# Altium project Control.PrjPCB
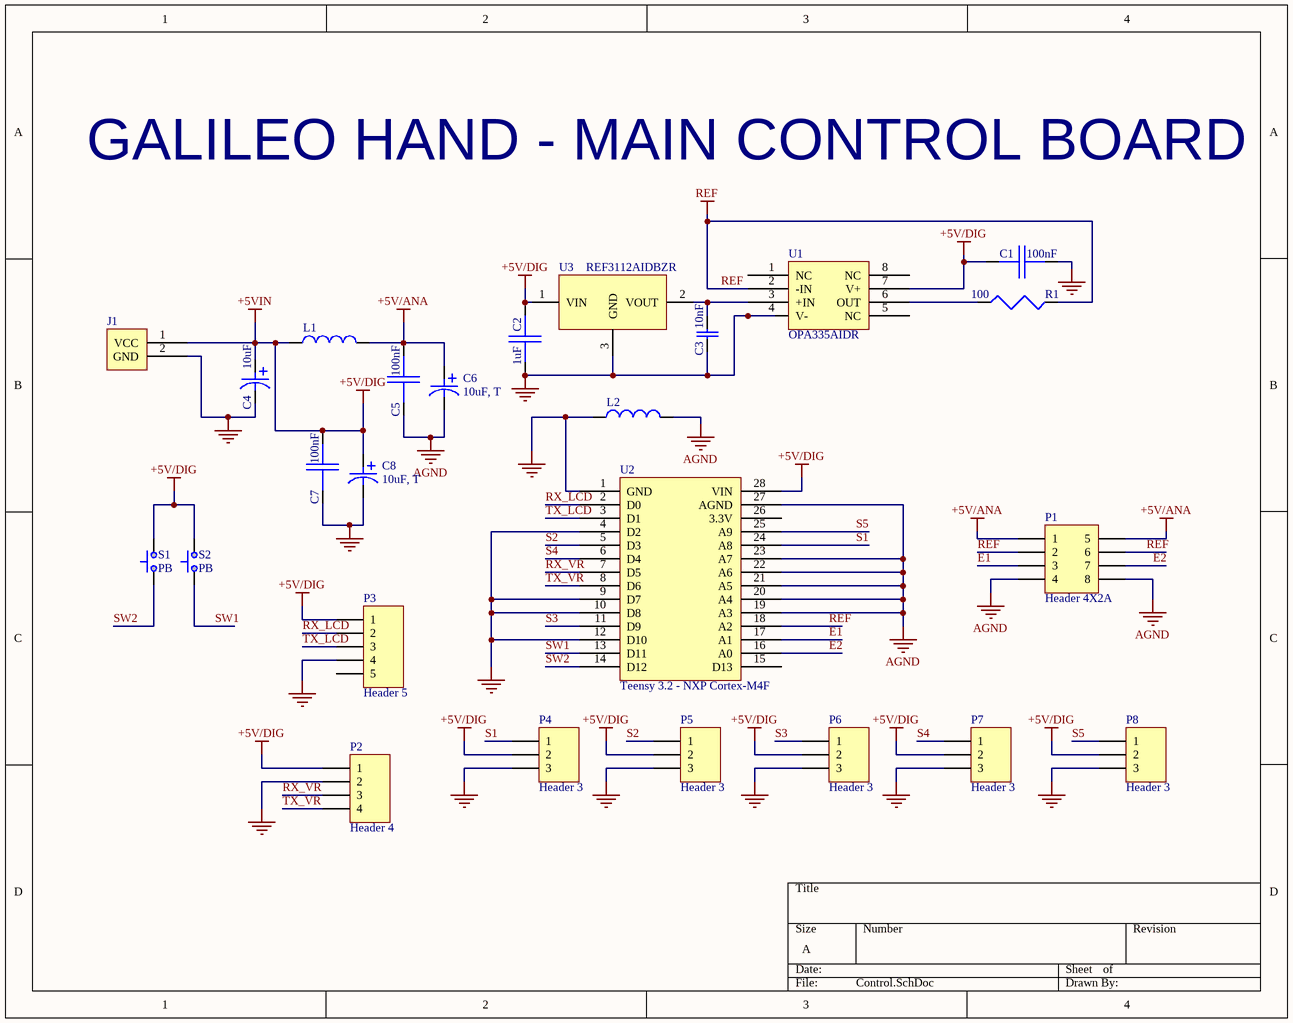
[diagram p0: Control.SchDoc]
1 sheet, 25 parts. Net scope: global (net labels, ports and power ports of the same name join across sheets).
Board file: Control.PcbDoc

## Sheet Control.SchDoc
size A

### Parts
C1  100nF  [C0603]
C2  1uF  [C0603]
C3  10nF  [C0805]
C4  10uF  [CSVB]
C5  100nF  [C0603]
C6  10uF, T  [C1206]
C7  100nF  [C0603]
C8  10uF, T  [C1206]
J1  TERMINAL BLOCK  2POS 3.5MM  [2POS3.5mm]  (value not drawn)
L1  EMI FILTER BED  [R0603]  (value not drawn)
L2  EMI FILTER BED  [R0603]  (value not drawn)
P1  Header 4X2A  [HDR2X4_CEN]
P2  Header 4  [HDR1X4]
P3  Header 5  [HDR1X5]
P4  Header 3  [HDR1X3]
P5  Header 3  [HDR1X3]
P6  Header 3  [HDR1X3]
P7  Header 3  [HDR1X3]
P8  Header 3  [HDR1X3]
R1  100  [R0603]
S1  PB  [SW]
S2  PB  [SW]
U1  OPA335AIDR  [SO-8]
U2  Teensy 3.2 - NXP Cortex-M4F  [DIP28]
U3  REF3112AIDBZR  [SOT-23]

### Nets
+5V/ANA: C5.2 C6.1 L1.2 P1.1 P1.5
+5V/DIG: C1.2 C2.2 C4.1 C7.2 C8.1 J1.1(VCC) L1.1 P2.1 P3.1 P4.2 P5.2 P6.2 P7.2 P8.2 S1.2 S2.2 U1.7(V+) U2.28(VIN) U3.1(VIN)  [also labelled +5VIN]
AGND: C5.1 C6.2 L2.2 P1.4 P1.8 U2.19(A3) U2.20(A4) U2.21(A5) U2.22(A6) U2.23(A7) U2.27(AGND)
GND: C1.1 C2.1 C3.1 C4.2 C7.1 C8.2 J1.2(GND) L2.1 P2.2 P3.4 P4.3 P5.3 P6.3 P7.3 P8.3 U1.4(V-) U2.1(GND) U2.4(D2) U2.9(D7) U2.10(D8) U2.12(D10) U3.3(GND)
REF: P1.2 P1.6 R1.1 U1.2(-IN) U2.18(A2)
E1: P1.3 U2.17(A1)
E2: P1.7 U2.16(A0)
RX_LCD: P3.2 U2.2(D0)
RX_VR: P2.3 U2.7(D5)
S1: P4.1 U2.24(A8)
S2: P5.1 U2.5(D3)
S3: P6.1 U2.11(D9)
S4: P7.1 U2.6(D4)
S5: P8.1 U2.25(A9)
SW1: S2.1 U2.13(D11)
SW2: S1.1 U2.14(D12)
TX_LCD: P3.3 U2.3(D1)
TX_VR: P2.4 U2.8(D6)
NetC3_2: C3.2 U1.3(+IN) U3.2(VOUT)
NetR1_2: R1.2 U1.6(OUT)

Not connected (* = marked no-connect by the designer): P3 5; U1 1(NC) 5(NC) 8(NC); U2 15(D13) 26(3.3V)

### Notes on the sheet
- GALILEO HAND - MAIN CONTROL BOARD

### Library data of the parts
C1 C5 C7 = GRM188R71E104KA01D: CAP CER 0.1UF 25V X7R 0603; Manufacturer: Murata Electronics North America; Capacitance: 0.1µF; Tolerance: ±10%; Supplier 1: Digi-Key; Manufacturer Part Number: GRM188R71E104KA01D; RoHS: RoHS Compliant; Category: Capacitors; Stock 1: 5973420; Pricing 1: 1=0.1, 10=0.019, 50=0.0104, 100=0.0088, 250=0.0072, 500=0.00616, 1000=0.0048 (USD); Packaging: Cut Tape (CT); Voltage - Rated: 25V; Temperature Coefficient: X7R; Mounting Type: Surface Mount, MLCC; Operating Temperature: -55°C ~ 125°C; Applications: General Purpose; Ratings: -; Package / Case: 0603 (1608 Metric); Size / Dimension: 0.063" L x 0.031" W (1.60mm x 0.80mm); Height - Seated (Max): -; Thickness (Max): 0.035" (0.90mm); Lead Spacing: -; Features: -; Lead Style: -; ComponentLink1URL: http://www.murata.com/~/media/webrenewal/support/library/catalog/products/capacitor/mlcc/c02e.pdf; ComponentLink1Description: http://www.murata.com/~/media/webrenewal/support/library/catalog/products/capacitor/mlcc/c02e.pdf; Supplier Part Number 1: 490-1524-1-ND
C2 = GRM188R61E105KA12D: CAP CER 1UF 25V X5R 0603; Manufacturer: Murata Electronics North America; Capacitance: 1µF; Tolerance: ±10%; Supplier 1: Digi-Key; Manufacturer Part Number: GRM188R61E105KA12D; RoHS: RoHS Compliant; Category: Capacitors; Stock 1: 1934941; Pricing 1: 1=0.1, 10=0.044, 50=0.0238, 100=0.0202, 250=0.01652, 500=0.01412, 1000=0.01101 (USD); Packaging: Cut Tape (CT); Voltage - Rated: 25V; Temperature Coefficient: X5R; Mounting Type: Surface Mount, MLCC; Operating Temperature: -55°C ~ 85°C; Applications: General Purpose; Ratings: -; Package / Case: 0603 (1608 Metric); Size / Dimension: 0.063" L x 0.031" W (1.60mm x 0.80mm); Height - Seated (Max): -; Thickness (Max): 0.035" (0.90mm); Lead Spacing: -; Features: -; Lead Style: -; ComponentLink1URL: http://www.murata.com/~/media/webrenewal/support/library/catalog/products/capacitor/mlcc/c02e.pdf; ComponentLink1Description: http://www.murata.com/~/media/webrenewal/support/library/catalog/products/capacitor/mlcc/c02e.pdf; Supplier Part Number 1: 490-3897-1-ND
C3 = GRM216R71H103KA01D: CAP CER 10000PF 50V X7R 0805; Manufacturer: Murata Electronics North America; Tolerance: ±10%; Supplier 1: Digi-Key; Manufacturer Part Number: GRM216R71H103KA01D; RoHS: RoHS Compliant; Category: Capacitors; Stock 1: 1473285; Pricing 1: 1=0.1, 10=0.031, 50=0.0168, 100=0.0142, 250=0.01164, 500=0.00998, 1000=0.00777 (USD); Packaging: Cut Tape (CT); Capacitance: 10000pF; Voltage - Rated: 50V; Temperature Coefficient: X7R; Mounting Type: Surface Mount, MLCC; Operating Temperature: -55°C ~ 125°C; Applications: General Purpose; Ratings: -; Package / Case: 0805 (2012 Metric); Size / Dimension: 0.079" L x 0.049" W (2.00mm x 1.25mm); Height - Seated (Max): -; Thickness (Max): 0.028" (0.70mm); Lead Spacing: -; Features: -; Lead Style: -; ComponentLink1URL: http://www.murata.com/~/media/webrenewal/support/library/catalog/products/capacitor/mlcc/c02e.pdf; ComponentLink1Description: http://www.murata.com/~/media/webrenewal/support/library/catalog/products/capacitor/mlcc/c02e.pdf; Supplier Part Number 1: 490-1664-1-ND
C4 = EEE-1EA100WR: CAP ALUM 10UF 20% 25V SMD; Manufacturer: Panasonic Electronic Components; Capacitance: 10µF; Lifetime @ Temp.: 1000 Hrs @ 85°C; Ripple Current: 22mA; Surface Mount Land Size: 0.169" L x 0.169" W (4.30mm x 4.30mm); Supplier 1: Digi-Key; Manufacturer Part Number: EEE-1EA100WR; RoHS: RoHS Compliant; Category: Capacitors; Stock 1: 144383; Pricing 1: 1=0.41, 10=0.319, 25=0.2612, 50=0.2102, 100=0.1668, 250=0.12324, 500=0.0957, 1000=0.0754 (USD); Packaging: Cut Tape (CT); Tolerance: ±20%; Voltage Rating: 25V; ESR (Equivalent Series Resistance): -; Operating Temperature: -40°C ~ 85°C; Type: -; Applications: Automotive; Impedance: -; Lead Spacing: -; Size / Dimension: 0.157" Dia (4.00mm); Height - Seated (Max): 0.213" (5.40mm); Mounting Type: Surface Mount; Package / Case: Radial, Can - SMD; ComponentLink1URL: http://media.digikey.com/pdf/Data%20Sheets/Panasonic%20Capacitors%20PDFs/EEE_S_A.pdf; ComponentLink1Description: http://media.digikey.com/pdf/Data%20Sheets/Panasonic%20Capacitors%20PDFs/EEE_S_A.pdf; Supplier Part Number 1: PCE3895CT-ND
C6 C8 = T491C106K020AT: CAP TANT 10UF 20V 10% 2413; Manufacturer: Kemet; Manufacturer Size Code: C; Capacitance: 10µF; ESR (Equivalent Series Resistance): 1.8 Ohm; Type: Molded; Lifetime @ Temp.: 2000 Hrs @ 85°C; Manufacturer Part Number: T491C106K020AT; RoHS: RoHS Compliant; Category: Capacitors; Packaging: Cut Tape (CT); Tolerance: ±10%; Voltage - Rated: 20V; Operating Temperature: -55°C ~ 125°C; Mounting Type: Surface Mount; Package / Case: 2413 (6032 Metric); Size / Dimension: 0.236" L x 0.126" W (6.00mm x 3.20mm); Height - Seated (Max): 0.110" (2.80mm); Lead Spacing: -; Features: General Purpose; ComponentLink1URL: http://www.kemet.com/Lists/ProductCatalog/Attachments/254/KEM_T2005_T491.pdf; ComponentLink1Description: http://www.kemet.com/Lists/ProductCatalog/Attachments/254/KEM_T2005_T491.pdf; Supplier 1: Digi-Key; Stock 1: 94667; Pricing 1: 1=0.73, 10=0.7, 50=0.418, 100=0.3396, 250=0.28216, 500=0.25602, 1000=0.23513 (USD); Supplier Part Number 1: 399-5152-6-ND
J1 = 0393570002: CONN TERMINAL BLOCK 2POS 3.5MM; Manufacturer: Molex, LLC; Number of Levels: 1; Positions Per Level: 2; Pitch: 0.138" (3.50mm); Mating Orientation: Horizontal with Board; Current: 12A; Voltage: 300V; Wire Gauge: 16-28 AWG; Wire Termination: Screw - Rising Cage Clamp; Clamp Material - Plating: Copper Alloy - Nickel Plated; Torque - Screw: 0.31 Nm (2.7 Lb-In); Screw Thread: M3; Supplier 1: Digi-Key; Manufacturer Part Number: 0393570002; RoHS: RoHS Compliant; Category: Connectors, Interconnects; Stock 1: 1266; Pricing 1: 1=1.1, 10=0.686, 50=0.528, 100=0.517, 250=0.44, 500=0.418, 1000=0.374, 2500=0.297, 5000=0.2926 (USD); Packaging: Bulk; Mounting Type: Through Hole; Features: -; Color: Black; Operating Temperature: -40°C ~ 105°C; Housing Material: Polyamide (PA), Nylon; Contact Material - Plating: Copper Alloy - Tin Plated; Screw Material - Plating: Copper Alloy - Nickel Plated; ComponentLink1URL: http://www.molex.com/pdm_docs/sd/393570002_sd.pdf; ComponentLink1Description: http://www.molex.com/pdm_docs/sd/393570002_sd.pdf; Supplier Part Number 1: WM7877-ND
L1 L2 = BLM18PG471SN1D: FERRITE BEAD 470 OHM 0603; Manufacturer: Murata Electronics North America; Filter Type: Power Line; Number of Lines: 1; Impedance @ Frequency: 470 Ohm @ 100MHz; Current Rating (Max): 1A; DC Resistance (DCR) (Max): 200 mOhm; Supplier 1: Digi-Key; Manufacturer Part Number: BLM18PG471SN1D; RoHS: RoHS Compliant; Category: Filters; Stock 1: 101023; Pricing 1: 1=0.1, 10=0.083, 50=0.0684, 100=0.0501, 250=0.03644, 500=0.0334, 1000=0.02884 (USD); Packaging: Cut Tape (CT); Ratings: -; Operating Temperature: -55°C ~ 125°C; Package / Case: 0603 (1608 Metric); Mounting Type: Surface Mount; Height (Max): 0.037" (0.95mm); Size / Dimension: 0.063" L x 0.031" W (1.60mm x 0.80mm); ComponentLink1URL: http://search.murata.co.jp/Ceramy/image/img/PDF/ENG/L0110S0100BLM18P.pdf; ComponentLink1Description: http://search.murata.co.jp/Ceramy/image/img/PDF/ENG/L0110S0100BLM18P.pdf; Supplier Part Number 1: 490-5223-1-ND
P1 = Header 4X2A: Header, 4-Pin, Dual row; LatestRevisionDate: 17-Jul-2002; LatestRevisionNote: Re-released for DXP Platform.; Publisher: Altium Limited
P2 = Header 4: Header, 4-Pin; LatestRevisionDate: 17-Jul-2002; LatestRevisionNote: Re-released for DXP Platform.; Publisher: Altium Limited
P3 = Header 5: Header, 5-Pin; LatestRevisionDate: 17-Jul-2002; LatestRevisionNote: Re-released for DXP Platform.; Publisher: Altium Limited
P4-P8 = Header 3: Header, 3-Pin; LatestRevisionDate: 17-Jul-2002; LatestRevisionNote: Re-released for DXP Platform.; Publisher: Altium Limited
R1 = ERJ-3EKF1000V: RES SMD 100 OHM 1% 1/10W 0603; Manufacturer: Panasonic Electronic Components; Power (Watts): 0.1W, 1/10W; Temperature Coefficient: ±100ppm/°C; Supplier 1: Digi-Key; Manufacturer Part Number: ERJ-3EKF1000V; RoHS: RoHS Compliant; Category: Resistors; Stock 1: 2225240; Pricing 1: 1=0.1, 50=0.0114, 100=0.0084, 250=0.00644, 500=0.00514, 1000=0.00379 (USD); Packaging: Cut Tape (CT); Resistance (Ohms): 100; Tolerance: ±1%; Composition: Thick Film; Features: Automotive AEC-Q200; Operating Temperature: -55°C ~ 155°C; Package / Case: 0603 (1608 Metric); Supplier Device Package: 0603; Size / Dimension: 0.063" L x 0.031" W (1.60mm x 0.80mm); Height: 0.022" (0.55mm); Number of Terminations: 2; ComponentLink1URL: http://industrial.panasonic.com/www-cgi/jvcr13pz.cgi?E+PZ+3+AOA0002+ERJ3EKF1000V+7+WW; ComponentLink1Description: http://industrial.panasonic.com/www-cgi/jvcr13pz.cgi?E+PZ+3+AOA0002+ERJ3EKF1000V+7+WW; Supplier Part Number 1: P100HCT-ND
S1 S2 = D6C90 F1 LFS: SWITCH PUSH SPST-NO 0.1A 32V; Manufacturer: C&K Components; Switch Function: Off-Mom; Current Rating: 100mA (DC); Actuator Type: Square, Button; Color - Actuator/Cap: Black; Electrical Life: 250,000 Cycles; Supplier 1: Digi-Key; Manufacturer Part Number: D6C90 F1 LFS; RoHS: RoHS Compliant; Category: Switches; Stock 1: 9241; Pricing 1: 1=0.82, 10=0.767, 25=0.73, 50=0.6936, 100=0.6753, 250=0.657, 500=0.6205, 1000=0.584, 2500=0.52925 (USD); Packaging: Bulk; Type: Keyswitch; Circuit: SPST-NO; Voltage Rating - AC: -; Voltage Rating - DC: 32V; Illumination Type, Color: -; Illumination Voltage (Nominal): -; Mounting Type: Through Hole; Termination Style: PC Pin; Ingress Protection: -; Features: Tactile Feedback; Panel Cutout Dimensions: -; Operating Temperature: -20°C ~ 85°C; Mechanical Life: -; ComponentLink1URL: http://www.ck-components.com/index.php?module=media&action=Display&cmpref=13327&lang=en&width=&height=&format=&alt=; ComponentLink1Description: http://www.ck-components.com/index.php?module=media&action=Display&cmpref=13327&lang=en&width=&height=&format=&alt=; Supplier Part Number 1: 401-1969-ND
U1 = OPA335AIDR: IC OPAMP CHOPPER 2MHZ RRO 8SOIC; Manufacturer: Texas Instruments; Amplifier Type: Zero-Drift; Number of Circuits: 1; Output Type: Rail-to-Rail; Slew Rate: 1.6 V/µs; Current - Input Bias: 70pA; Voltage - Input Offset: 1µV; Current - Supply: 285µA; Current - Output / Channel: 50mA; Voltage - Supply, Single/Dual (±): 2.7 V ~ 5.5 V, ±1.35 V ~ 2.75 V; Supplier 1: Digi-Key; Manufacturer Part Number: OPA335AIDR; RoHS: RoHS Compliant; Category: Integrated Circuits (ICs); Stock 1: 1160; Pricing 1: 1=2.89, 10=2.594, 100=2.0805, 500=1.71, 1000=1.4155 (USD); Packaging: Cut Tape (CT); Gain Bandwidth Product: 2MHz; -3db Bandwidth: -; Operating Temperature: -40°C ~ 125°C; Mounting Type: Surface Mount; Package / Case: 8-SOIC (0.154", 3.90mm Width); Supplier Device Package: 8-SOIC; ComponentLink1URL: http://www.ti.com/lit/ds/symlink/opa334.pdf; ComponentLink1Description: http://www.ti.com/lit/ds/symlink/opa334.pdf; Supplier Part Number 1: 296-39124-1-ND
U2 = Teensy: Manufacturer: SparkFun Electronics; Manufacturer Part Number: DEV-13305; Board Type: Evaluation Platform; Core Processor: ARM® Cortex®-M0+; Platform: Teensy-LC; For Use With/Related Products: KL2x; Contents: Board(s); Supplier 1: Digi-Key; RoHS: RoHS Compliant; Category: Programmers, Development Systems; Stock 1: 0; Pricing 1: 1=14.38 (USD); Type: MCU 32-Bit; Operating System: -; Mounting Type: Fixed; ComponentLink1URL: http://media.digikey.com/pdf/Data%20Sheets/Sparkfun%20PDFs/DEV-13305_Web.pdf; ComponentLink1Description: http://media.digikey.com/pdf/Data%20Sheets/Sparkfun%20PDFs/DEV-13305_Web.pdf; Supplier Part Number 1: 1568-1233-ND
U3 = REF3112AIDBZR: IC VREF SERIES 1.25V SOT23-3; Manufacturer: Texas Instruments; Output Type: Fixed; Current - Output: 10mA; Tolerance: ±0.2%; Temperature Coefficient: 20ppm/°C; Noise - 0.1Hz to 10Hz: 17µVp-p; Noise - 10Hz to 10kHz: 24µVrms; Voltage - Input: 1.8 V ~ 5.5 V; Current - Supply: 135µA; Supplier 1: Digi-Key; Manufacturer Part Number: REF3112AIDBZR; RoHS: RoHS Compliant; Category: Integrated Circuits (ICs); Stock 1: 1754; Pricing 1: 1=2.71, 10=2.432, 100=1.9513, 500=1.6038, 1000=1.11375 (USD); Packaging: Cut Tape (CT); Reference Type: Series; Voltage - Output (Min/Fixed): 1.25V; Voltage - Output (Max): -; Current - Cathode: -; Operating Temperature: -40°C ~ 125°C (TA); Mounting Type: Surface Mount; Package / Case: TO-236-3, SC-59, SOT-23-3; Supplier Device Package: SOT-23-3; ComponentLink1URL: http://www.ti.com/lit/ds/symlink/ref3112.pdf; ComponentLink1Description: http://www.ti.com/lit/ds/symlink/ref3112.pdf; Supplier Part Number 1: 296-39158-1-ND